# EAGLE design thunder (EAGLE 7.1.0)
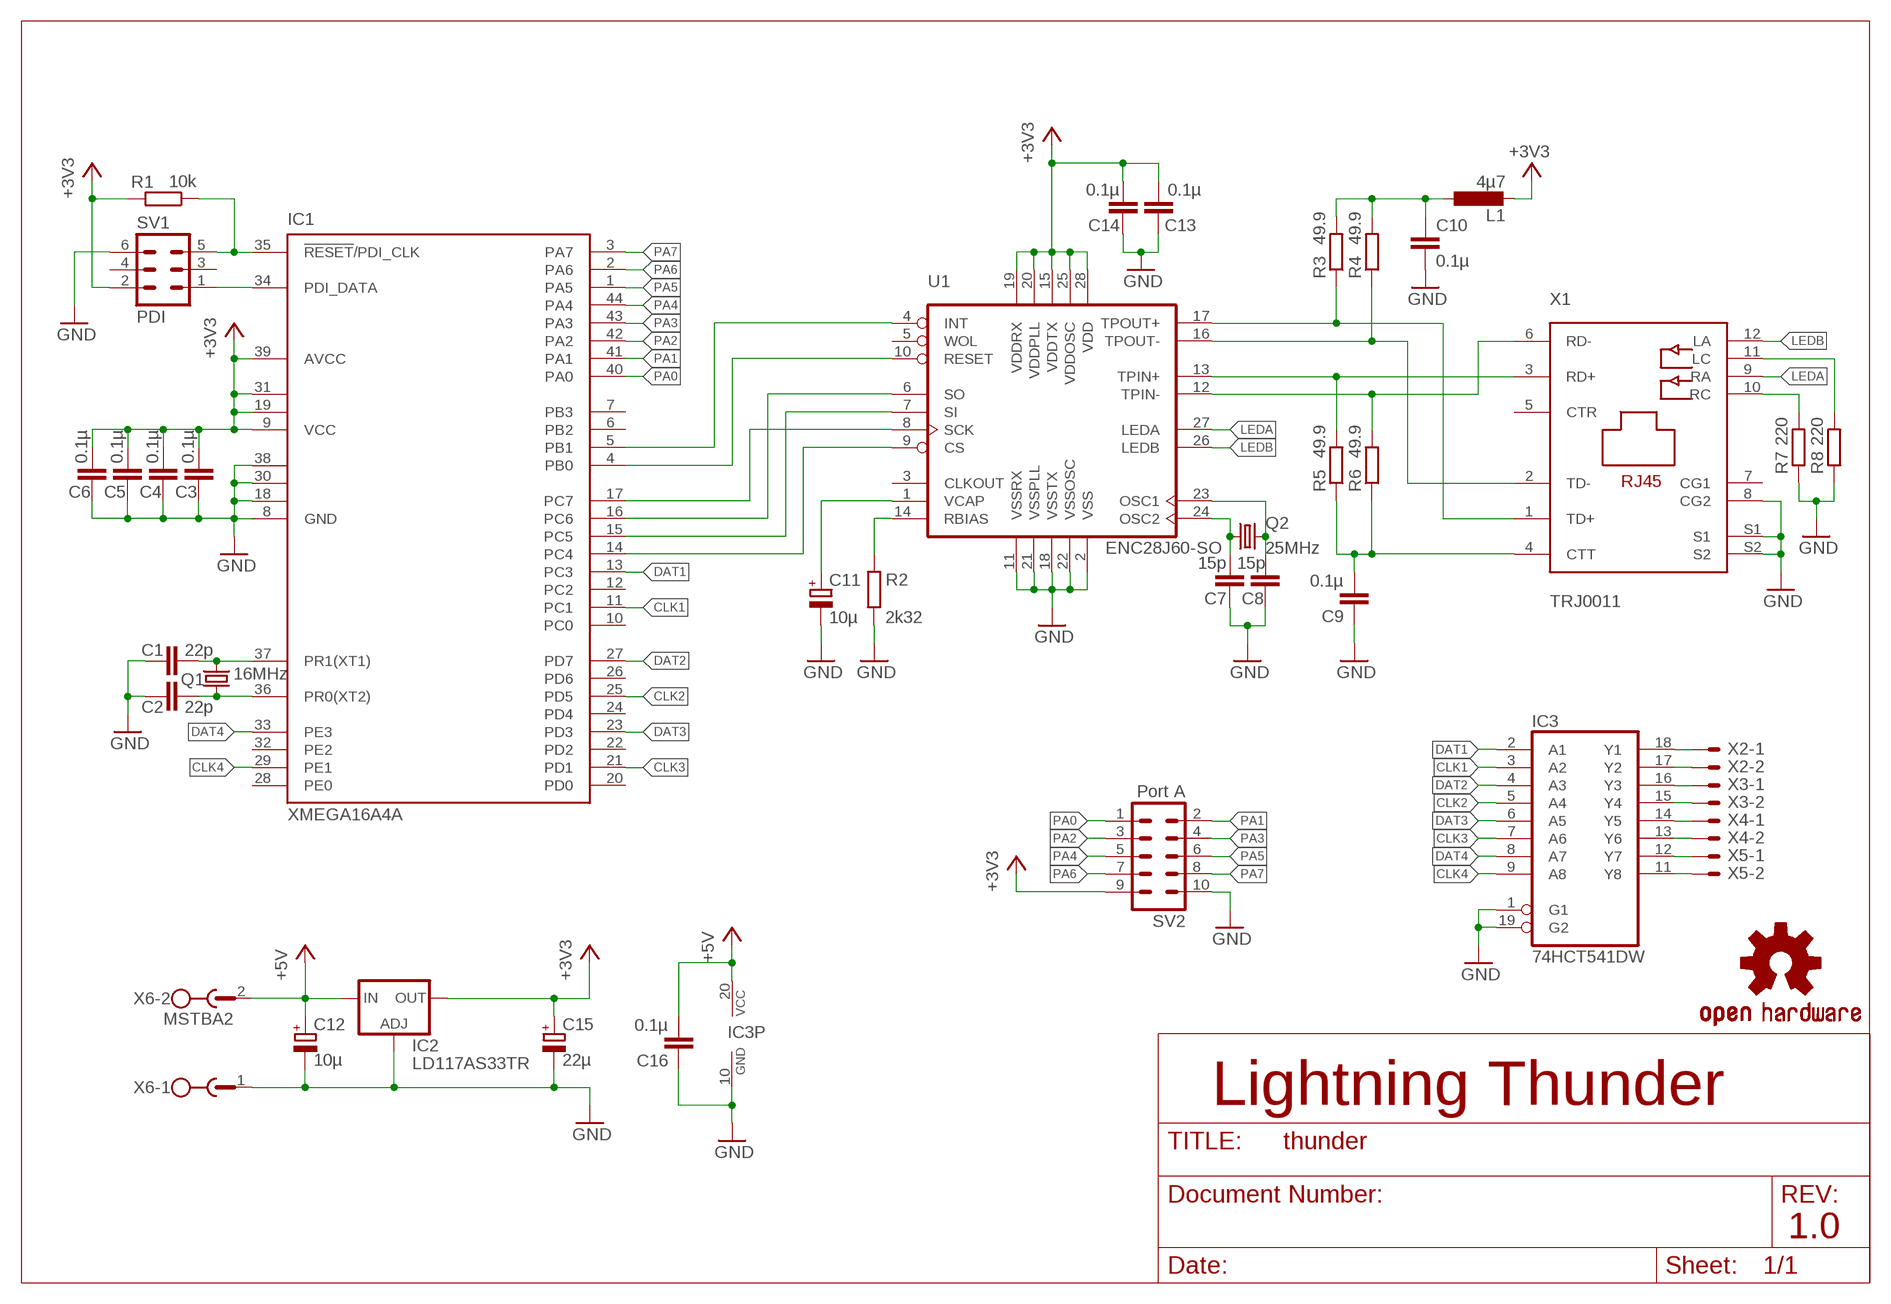
[diagram p0: schematic, sheet 1]

## Parts
C1  22p  C-EUC0805  [C0805]
C2  22p  C-EUC0805  [C0805]
C3  0.1µ  C-EUC0805  [C0805]
C4  0.1µ  C-EUC0805  [C0805]
C5  0.1µ  C-EUC0805  [C0805]
C6  0.1µ  C-EUC0805  [C0805]
C7  15p  C-EUC0805  [C0805]
C8  15p  C-EUC0805  [C0805]
C9  0.1µ  C-EUC0805  [C0805]
C10  0.1µ  C-EUC0805  [C0805]
C11  10µ  CPOL-EUB/3528-21R  [B/3528-21R]
C12  10µ  CPOL-EUB/3528-21R  [B/3528-21R]
C13  0.1µ  C-EUC0805  [C0805]
C14  0.1µ  C-EUC0805  [C0805]
C15  22µ  CPOL-EUB/3528-21R  [B/3528-21R]
C16  0.1µ  C-EUC0805  [C0805]
IC1  XMEGA16A4A  [TQFP44]
IC2  LD117AS33TR  [SOT223]
IC3  74HCT541DW  [SO20W]
L1  4µ7  L-EUL3225M  [L3225M]
LOGO1  OSHW-LOGOS  [OSHW-LOGO-S]
Q1  16MHz  CRYSTALHC49U-V  [HC49U-V]
Q2  25MHz  CRYSTALHC49U-V  [HC49U-V]
R1  10k  R-EU_R0805  [R0805]
R2  2k32  R-EU_R0805  [R0805]
R3  49.9  R-EU_R0805  [R0805]
R4  49.9  R-EU_R0805  [R0805]
R5  49.9  R-EU_R0805  [R0805]
R6  49.9  R-EU_R0805  [R0805]
R7  220  R-EU_R0805  [R0805]
R8  220  R-EU_R0805  [R0805]
SV1  PDI  ML6  [ML6]
SV2  Port A  MA05-2  [MA05-2]
U1  ENC28J60-SO  [SO28W]
X1  TRJ0011  [TRJ0011]
X2  AKL18X-02W  [AKL182-02]
X3  AKL18X-02W  [AKL182-02]
X4  AKL18X-02W  [AKL182-02]
X5  AKL18X-02W  [AKL182-02]
X6  MSTBA2  [MSTBA2]

## Nets
+3V3: C3.2 C4.2 C5.2 C6.2 C13.2 C14.2 C15.+ IC1.9(VCC) IC1.19(VCC1) IC1.31(VCC2) IC1.39(AVCC) IC2.4(OUT) L1.2 R1.2 SV1.2 SV2.9 U1.15(VDDTX) U1.19(VDDRX) U1.20(VDDPLL) U1.25(VDDOSC) U1.28(VDD)
+5V: C12.+ C16.2 IC2.3(IN) IC3.20(VCC) X6.2
CLK1: IC1.11(PC1) IC3.3(A2)
CLK2: IC1.25(PD5) IC3.5(A4)
CLK3: IC1.21(PD1) IC3.7(A6)
CLK4: IC1.29(PE1) IC3.9(A8)
DAT1: IC1.13(PC3) IC3.2(A1)
DAT2: IC1.27(PD7) IC3.4(A3)
DAT3: IC1.23(PD3) IC3.6(A5)
DAT4: IC1.33(PE3) IC3.8(A7)
GND: C1.1 C2.1 C3.1 C4.1 C5.1 C6.1 C7.1 C8.1 C9.1 C10.2 C11.- C12.- C13.1 C14.1 C15.- C16.1 IC1.8(GND) IC1.18(GND1) IC1.30(GND2) IC1.38(GND3) IC2.1(ADJ) IC3.1(G1) IC3.10(GND) IC3.19(G2) R2.1 R7.1 R8.1 SV1.6 SV2.10 U1.2(VSS) U1.11(VSSRX) U1.18(VSSTX) U1.21(VSSPLL) U1.22(VSSOSC) X1.8(CG2) X1.S1 X1.S2 X6.1
LEDA: U1.27(LEDA) X1.9(RA)
LEDB: U1.26(LEDB) X1.12(LA)
N$1: IC1.34(PDI_DATA) SV1.1
N$2: IC1.35(!RESET!/PDI_CLK) R1.1 SV1.5
N$3: C2.2 IC1.36(PR0(XT2)) Q1.1
N$4: C1.2 IC1.37(PR1(XT1)) Q1.2
N$5: IC1.14(PC4) U1.9(CS)
N$6: IC1.17(PC7) U1.8(SCK)
N$7: IC1.16(PC6) U1.6(SO)
N$8: IC1.15(PC5) U1.7(SI)
N$9: IC1.4(PB0) U1.10(RESET)
N$10: IC1.5(PB1) U1.4(INT)
N$11: R3.1 U1.17(TPOUT+) X1.1(TD+)
N$12: R4.1 U1.16(TPOUT-) X1.2(TD-)
N$13: R5.2 U1.13(TPIN+) X1.3(RD+)
N$14: R6.2 U1.12(TPIN-) X1.6(RD-)
N$15: R2.2 U1.14(RBIAS)
N$16: C10.1 L1.1 R3.2 R4.2
N$17: C9.2 R5.1 R6.1 X1.4(CTT)
N$18: C11.+ U1.1(VCAP)
N$19: IC3.18(Y1) X2.P$1
N$20: C7.2 Q2.1 U1.24(OSC2)
N$21: C8.2 Q2.2 U1.23(OSC1)
N$22: IC3.17(Y2) X2.P$2
N$23: IC3.16(Y3) X3.P$1
N$24: IC3.15(Y4) X3.P$2
N$25: R7.2 X1.10(RC)
N$26: R8.2 X1.11(LC)
N$27: IC3.14(Y5) X4.P$1
N$28: IC3.13(Y6) X4.P$2
N$29: IC3.12(Y7) X5.P$1
N$30: IC3.11(Y8) X5.P$2
PA0: IC1.40(PA0) SV2.1
PA1: IC1.41(PA1) SV2.2
PA2: IC1.42(PA2) SV2.3
PA3: IC1.43(PA3) SV2.4
PA4: IC1.44(PA4) SV2.5
PA5: IC1.1(PA5) SV2.6
PA6: IC1.2(PA6) SV2.7
PA7: IC1.3(PA7) SV2.8
Unconnected: IC1.6(PB2) IC1.7(PB3) IC1.10(PC0) IC1.12(PC2) IC1.20(PD0) IC1.22(PD2) IC1.24(PD4) IC1.26(PD6) IC1.28(PE0) IC1.32(PE2) SV1.3 SV1.4 U1.3(CLKOUT) U1.5(WOL) X1.5(CTR) X1.7(CG1)

## Notes on the sheet
- Lightning Thunder
- 1.0

## Library data of the parts
C1-C10 C13 C14 C16 = rcl:C-EU: CAPACITOR, European symbol
C11 C12 C15 = rcl:CPOL-EU: POLARIZED CAPACITOR, European symbol
IC1 = atmel:XMEGA16A4: MICROCONTROLLER Features High-performance, Low-power 8/16-bit AVR XMEGA Microcontroller Non-Volatile Program and Data Memories - 16 KB - 128 KB of In-System Self-Programmable Flash - 4 KB - 8 KB Boot Code Section with Independent Lock Bits - 1 KB - 2 KB EEPROM - 2 KB - 8 KB Internal SRAM Peripheral Features - Four-channel DMA Controller with support for external requests - Eight-channel Event System - Five 16-bit Timer/Counters Three Timer/Counters with 4 Output Compare or Input Capture channels Two Timer/Counters with 2 Output Compare or Input Capture channels High-Resolution Extensions on all Timer/Counters Advanced Waveform Extension on one Timer/Counter - Five USARTs IrDA Extension on one USART - Two Two-Wire Interfaces with dual address match (I2C and SMBus compatible) - Two SPIs (Serial Peripheral Interfaces) peripherals - AES and DES Crypto Engine - 16-bit Real Time Counter with Separate Oscillator - One Twelve-channel, 12-bit, 2 Msps Analog to Digital Converter - One Two-channel, 12-bit, 1 Msps Digital to Analog Converter - Two Analog Comparators with Window compare function - External Interrupts on all General Purpose I/O pins - Programmable Watchdog Timer with Separate On-chip Ultra Low Power Oscillator Special Microcontroller Features - Power-on Reset and Programmable Brown-out Detection - Internal and External Clock Options with PLL - Programmable Multi-level Interrupt Controller - Sleep Modes: Idle, Power-down, Standby, Power-save, Extended Standby - Advanced Programming, Test and Debugging Interfaces PDI (Program and Debug Interface) for programming, test and debugging I/O and Packages - 34 Programmable I/O Lines - 44 - lead TQFP - 44 - pad VQFN/QFN - 49 - ball VFBGA Operating Voltage - 1.6 - 3.6V Speed performance - 0 - 12 MHz @ 1.6 - 3.6V - 0 - 32 MHz @ 2.7 - 3.6V Drawn by Dipl.-Ing. (FH) Robert Siegler Created: 27.05.09; OC_FARNELL: unknown; OC_NEWARK: unknown
IC2 = v-reg:LD117A?*: Low drop fixed and adjustable positive voltage regulators 1 A Source: http://www.st.com/stonline/products/literature/ds/7194/ld1117axx.pdf
IC3 = 74xx-eu:74*541: Octal BUFFER and LINE DRIVER, 3-state
L1 = rcl:L-EU: INDUCTOR, European symbol
LOGO1 = SparkFun-Aesthetics:OSHW-LOGO: Open Source Hardware Logo This logo indicates the piece of hardware it is found on incorporates a OSHW license and/or adheres to the definition of open source hardware found here: http://freedomdefined.org/OSHW
Q1 Q2 = crystal:CRYSTAL: CRYSTAL; OC_FARNELL: 1666969; OC_NEWARK: unknown
R1-R8 = rcl:R-EU_: RESISTOR, European symbol
SV1 = con-ml:ML6: HARTING; OC_FARNELL: unknown; OC_NEWARK: unknown
SV2 = con-lstb:MA05-2: PIN HEADER; OC_FARNELL: unknown; OC_NEWARK: unknown
U1 = enc28j60centered:ENC28J60-*: Microchip 10Mbit Ethernet controller with SPI interface Improved SOIC28 layout (pads in 0.01 raster, pin1 slightly smaller). Pin 6 (SO) changed from Out (paralleling several Outs gives an error) to OC. Author: Profi from mikrocontroller.net - forum Date: 2006.0827
X1 = trj0011:TRJ0011
X2-X5 = con-riacon_akl:AKL18X-02: Riacon AKL18X Steckverbinder 2-Pol Grid = 3,5mm
X6 = con-phoenix-508:MSTBA2: PHOENIX; MF: FARNELL; MPN: 1757242; OC_FARNELL: 3705171; OC_NEWARK: 71C4161

## Board
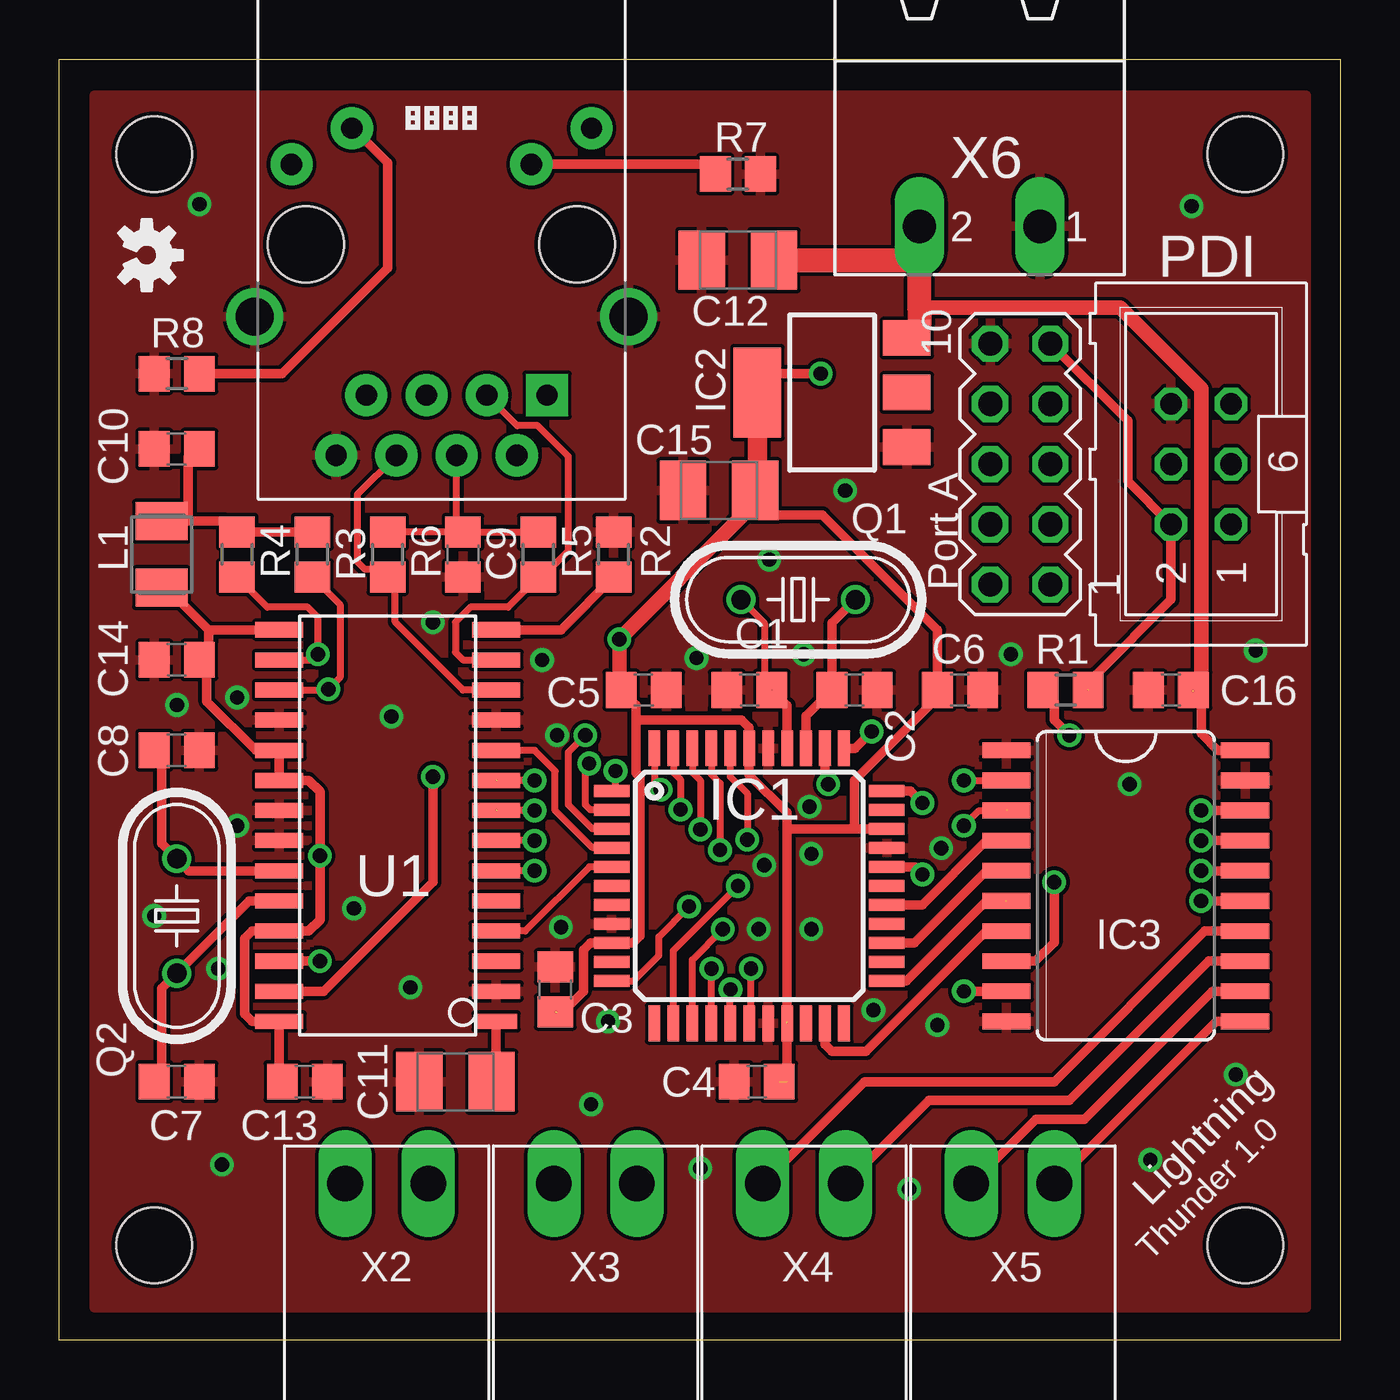
[diagram p1: board, top side]
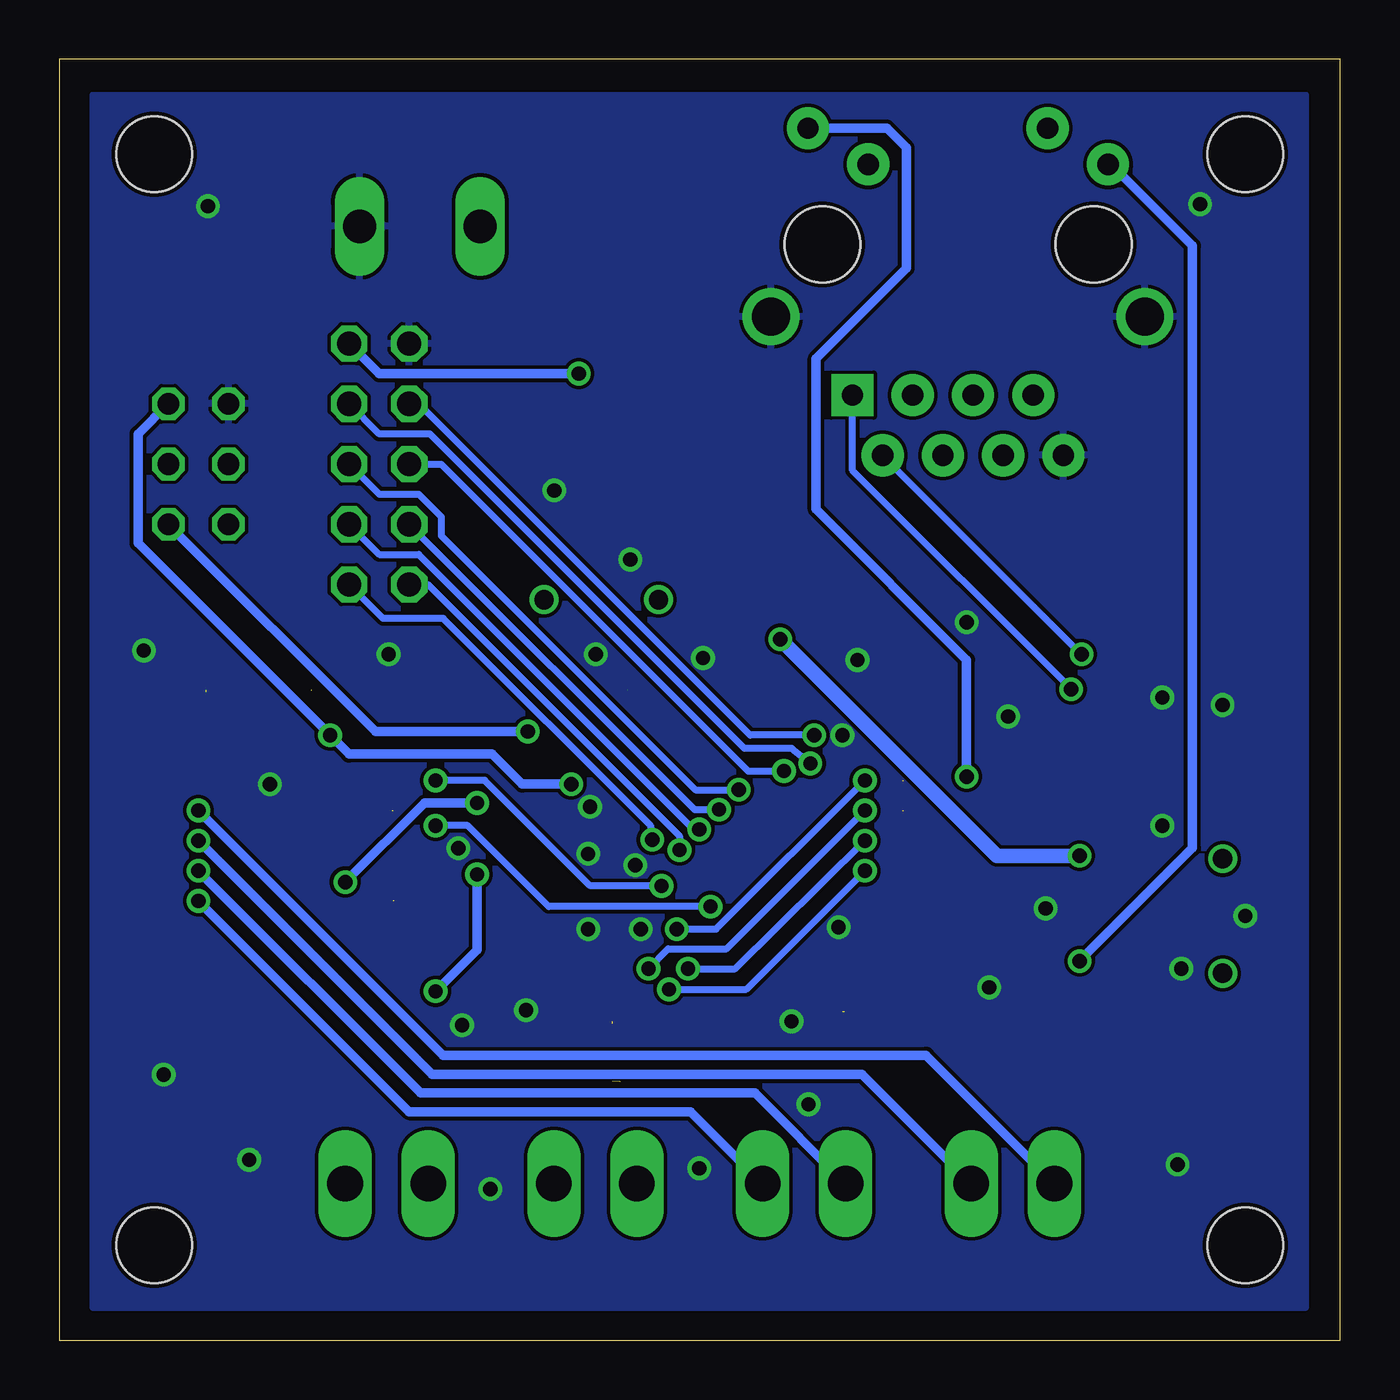
[diagram p2: board, bottom side, seen from below]

Size 54 x 54 mm. Coordinates in mm from the lower left corner, seen from the top.
Outline: 0,54 54,54 54,0 0,0 0,54
Copper layers (1*16): Top 0.035mm / dielectric 1.5mm / Bottom 0.035mm
Design rules "default": minimum track width 0.15mm, minimum drill 0.3mm, track to track 0.15mm, track to pad 0.15mm, pad to pad 0.15mm, via to via 0.15mm, smd to smd 0mil, copper to edge 0.2mm, drill to drill 0.2mm, minimum pad ring 0.2mm, minimum via ring 0.2mm, stop-mask expansion 4mil, vias tented up to drill 0.8mm, thermal gap 0.15mm
Holes 3.2 mm at 4,4 50,4 50,50 4,50

### Footprints (pad centres in the part's own frame; a part is rotated, then mirrored left to right if it is on the bottom)
C0805 = smd 1.3 x 1.5: 1 -0.95,0; 2 0.95,0
B/3528-21R = smd 1.95 x 2.5: + 1.525,0; - -1.525,0
TQFP44 = smd 1.5 x 0.5: 1 -5.8,4; 2 -5.8,3.2; 3 -5.8,2.4; 4 -5.8,1.6; 5 -5.8,0.8; 6 -5.8,0; 7 -5.8,-0.8; 8 -5.8,-1.6; 9 -5.8,-2.4; 10 -5.8,-3.2; 11 -5.8,-4; 23 5.8,-4; 24 5.8,-3.2; 25 5.8,-2.4; 26 5.8,-1.6; 27 5.8,-0.8; 28 5.8,0; 29 5.8,0.8; 30 5.8,1.6; 31 5.8,2.4; 32 5.8,3.2; 33 5.8,4 | smd 0.5 x 1.5: 12 -4,-5.8; 13 -3.2,-5.8; 14 -2.4,-5.8; 15 -1.6,-5.8; 16 -0.8,-5.8; 17 0,-5.8; 18 0.8,-5.8; 19 1.6,-5.8; 20 2.4,-5.8; 21 3.2,-5.8; 22 4,-5.8; 34 4,5.8; 35 3.2,5.8; 36 2.4,5.8; 37 1.6,5.8; 38 0.8,5.8; 39 0,5.8; 40 -0.8,5.8; 41 -1.6,5.8; 42 -2.4,5.8; 43 -3.2,5.8; 44 -4,5.8
SOT223 = smd 1.5 x 2: 1 -2.3,-3.15; 2 0,-3.15; 3 2.3,-3.15 | smd 3.8 x 2: 4 0,3.15
SO20W = smd 0.66 x 2.032: 1 -5.715,-5.029; 2 -4.445,-5.029; 3 -3.175,-5.029; 4 -1.905,-5.029; 5 -0.635,-5.029; 6 0.635,-5.029; 7 1.905,-5.029; 8 3.175,-5.029; 9 4.445,-5.029; 10 5.715,-5.029; 11 5.715,5.029; 12 4.445,5.029; 13 3.175,5.029; 14 1.905,5.029; 15 0.635,5.029; 16 -0.635,5.029; 17 -1.905,5.029; 18 -3.175,5.029; 19 -4.445,5.029; 20 -5.715,5.029
L3225M = smd 1.6 x 2.2: 1 -1.4,0; 2 1.4,0
HC49U-V = drill 0.813: 1 -2.413,0; 2 2.413,0
R0805 = smd 1.3 x 1.5: 1 -0.95,0; 2 0.95,0
ML6 = drill 0.914 octagon: 1 -2.54,-1.27; 2 -2.54,1.27; 3 0,-1.27; 4 0,1.27; 5 2.54,-1.27; 6 2.54,1.27
MA05-2 = drill 1.016 octagon: 1 -5.08,-1.27; 2 -5.08,1.27; 3 -2.54,-1.27; 4 -2.54,1.27; 5 0,-1.27; 6 0,1.27; 7 2.54,-1.27; 8 2.54,1.27; 9 5.08,-1.27; 10 5.08,1.27
SO28W = smd 0.635 x 1.778: 1 -8.255,-4.572 | smd 0.635 x 2.032: 2 -6.985,-4.572; 3 -5.715,-4.572; 4 -4.445,-4.572; 5 -3.175,-4.572; 6 -1.905,-4.572; 7 -0.635,-4.572; 8 0.635,-4.572; 9 1.905,-4.572; 10 3.175,-4.572; 11 4.445,-4.572; 12 5.715,-4.572; 13 6.985,-4.572; 14 8.255,-4.572; 15 8.255,4.572; 16 6.985,4.572; 17 5.715,4.572; 18 4.445,4.572; 19 3.175,4.572; 20 1.905,4.572; 21 0.635,4.572; 22 -0.635,4.572; 23 -1.905,4.572; 24 -3.175,4.572; 25 -4.445,4.572; 26 -5.715,4.572; 27 -6.985,4.572; 28 -8.255,4.572
TRJ0011 = drill 0.9 pad 1.778 square: 1 4.445,-6.35 | drill 0.9 pad 1.778: 2 3.175,-8.89; 3 1.905,-6.35; 4 0.635,-8.89; 5 -0.635,-6.35; 6 -1.905,-8.89; 7 -3.175,-6.35; 8 -4.445,-8.89; 9 6.325,4.902; 10 3.785,3.378; 11 -3.785,4.902; 12 -6.325,3.378 | drill 1.6: S1 -7.874,-3.048; S2 7.874,-3.048 | hole 3.2: -5.715,0; 5.715,0
AKL182-02 = drill 1.5 pad 2.184 long: P$1 -1.75,0; P$2 1.75,0
MSTBA2 = drill 1.397 long: 1 -2.54,5.08; 2 2.54,5.08

### Placement (x,y rotation side)
C1  29.09,27.41 0 top
C2  33.53,27.41 180 top
C3  20.91,14.79 270 top
C4  29.4,10.9 0 top
C5  24.64,27.41 180 top
C6  37.98,27.41 180 top
C7  4.95,10.9 180 top
C8  4.95,24.87 180 top
C9  17.02,33.12 90 top
C10  4.95,37.57 180 top
C11  16.7,10.9 0 top
C12  28.61,45.53 0 top
C13  10.35,10.9 180 top
C14  4.95,28.68 0 top
C15  27.81,35.82 0 top
C16  46.87,27.41 0 top
IC1  29.09,19.16 0 top
IC2  32.58,39.95 90 top
IC3  44.96,19.16 270 top
L1  4.32,33.12 270 top
LOGO1  3.68,45.75 270 top
Q1  31.15,31.22 180 top
Q2  4.95,17.88 90 top
R1  42.42,27.41 0 top
R2  23.37,33.12 270 top
R3  10.67,33.12 90 top
R4  7.5,33.12 90 top
R5  20.2,33.12 270 top
R6  13.84,33.12 270 top
R7  28.61,49.16 180 top
R8  4.95,40.74 0 top
SV1  48.14,36.94 90 top
SV2  40.52,36.94 90 top
U1  13.84,21.7 90 top
U$1  [LP_NUMBER_SILK_TOP]  14.4,50.83 0 top
X1  16.12,46.2 0 top
X2  13.8,6.6 0 top
X3  22.6,6.6 0 top
X4  31.4,6.6 0 top
X5  40.2,6.6 0 top
X6  38.8,52.04 180 top

### Tracks (layer width: path | path; a pad name or v marks a point on that pad's centre or on a via)
+3V3  (via drill 0.6)  (4 unrouted)
  Top 0.406: 6.3,29.95 6.3,29.16 C14.2 6.22,28.36 6.22,26.94 8.29,24.87 U1.19 U1.20 10.51,23.6 10.99,23.12 v10.99,20.42 10.99,17.73 10.51,17.25 U1.25 8.13,17.25 7.81,16.93 7.81,13.76 8.13,13.44 U1.28 9.27,11.03 C13.2 | 6.3,29.95 U1.15 | 6.3,29.95 4.56,31.7 L1.2 | 30.67,21.55 30.67,13.44 | IC1.31 33.53,21.55 | 33.53,21.55 30.67,21.55 | 33.53,21.55 33.53,23.6 37.02,27.09 C6.2 37.02,29.95 32.18,34.79 30.01,34.79 29.43,35.85 | IC1.19 30.69,10.91 30.67,10.9 | 30.67,21.55 30.67,22.25 29.09,23.84 IC1.39 29.09,25.82 28.77,26.14 24.32,26.14 | 24.32,26.14 24.32,23.92 24.48,23.76 24.48,17.05 24.18,16.75 IC1.9 22.4,16.75 22.1,16.46 22.1,14.71 21.23,13.84 20.99,13.84 | 24.32,26.14 24.32,26.78 C5.2 | SV2.9 45.04,38.76 45.04,36.22 SV1.2 46.87,31.22 43.69,28.05 43.69,27.73 R1.2 | v32.1,40.74 29.64,40.74 29.43,40.53 IC2.4
  Top 0.61: C15.+ 28.77,35.25 28.77,34.71 v23.61,29.55 23.61,27.49 C5.2
  Top 0.813: IC2.4 29.43,35.85 29.4,35.82
  Bottom 0.406: SV2.9 40.52,40.74 v32.1,40.74
  Bottom 0.61: v10.99,20.42 14.48,20.42 v23.61,29.55
+5V  (1 unrouted)
  Top 0.406: IC3.20 48.85,24.87 48.14,25.58 48.14,27.01 47.82,27.33 47.9,27.41
  Top 0.61: C16.2 48.14,27.73 48.14,40.11 44.72,43.52 36.26,43.52
  Top 1.016: IC2.3 36.26,42.78 36.26,43.52 36.26,45.51 | C12.+ 36.2,45.53 | 36.2,45.53 36.23,45.51 | 36.26,45.51 X6.2 | 36.2,45.53 36.24,45.53 36.26,45.51
CLK1  (via drill 0.6)  (1 unrouted)
  Top 0.305: IC1.11 24.21,15.16 25.27,16.22 25.27,17.01 v26.55,18.28 | v38.13,21.7 38.77,22.33 39.96,22.33
  Bottom 0.305: v26.55,18.28 33.37,18.28 36.78,21.7 v38.13,21.7
CLK2
  Top 0.406: IC1.25 36.05,16.75 39.09,19.79 IC3.5
CLK3
  Top 0.406: IC1.21 32.28,12.46 32.58,12.17 34.01,12.17 39.09,17.25 IC3.7
CLK4  (via drill 0.6)
  Top 0.406: IC1.29 36.06,19.95 v36.39,19.63 | v38.13,14.71 IC3.9
  Bottom 0.406: v36.39,19.63 36.39,16.46 v38.13,14.71
DAT1  (via drill 0.6)
  Top 0.305: IC1.13 25.88,16.43 v28.61,19.16 | v38.13,23.6 IC3.2
  Bottom 0.305: v28.61,19.16 31.62,19.16 36.07,23.6 v38.13,23.6
DAT2
  Top 0.406: IC1.27 36.38,18.35 39.09,21.06 IC3.4
DAT3  (1 unrouted)
  Top 0.406: IC1.23 35.72,15.16 39.09,18.52 39.88,18.52
DAT4  (via drill 0.6)
  Top 0.406: IC1.33 35.88,23.16 v36.39,22.65 | v41.94,19.31 41.94,16.77 41.15,15.98 IC3.8
  Bottom 0.406: v36.39,22.65 38.61,22.65 v41.94,19.31
GND  (via drill 0.6)
  other vias: 15.75,30.27 31.62,22.49 29.92,32.91 14,26.3 35.83,6.38 33.13,35.82 47.74,47.81 6.86,7.41 31.7,20.5 45.12,23.44 21.15,17.41 37.02,13.28 27.02,7.25 37.18,20.74 12.42,18.2 14.8,14.87 4.95,26.77 7.5,21.7 4,17.88 6.7,15.66 20.35,28.68 34.32,13.92 7.5,27.09 5.91,47.89 46,7.6 49.6,11.2 31.39,28.92 29.48,17.33 31.7,17.33 29.72,20.03 26.86,28.76 20.99,25.51 23.13,13.44 22.42,9.95 40.12,28.92 50.44,29.08
  pour Bottom: 1.46,1.38 52.58,1.38 52.58,52.49 1.46,52.49
  pour Top: 1.46,52.49 52.58,52.49 52.58,1.38 1.46,1.38
LEDA  (via drill 0.6)
  Top 0.406: U1.27 11.15,14.71 15.75,19.31 v15.75,23.76
  Bottom 0.406: X1.9 19.12,51.1 18.29,50.27 18.29,45.19 22.1,41.38 22.1,35.03 15.75,28.68 v15.75,23.76
LEDB  (via drill 0.6)
  Top 0.406: U1.26 v10.99,15.98
  Bottom 0.406: v10.99,15.98 6.23,20.74 6.23,46.14 9.47,49.39 X1.12
N$1  (via drill 0.6)
  Top 0.406: IC1.34 33.54,24.95 v34.24,25.66
  Bottom 0.406: v34.24,25.66 40.67,25.66 SV1.1
N$2  (via drill 0.6)
  Top 0.406: IC1.35 32.28,23.58 v32.42,23.44 | v42.58,25.51 41.94,26.14 41.94,26.94 R1.1
  Bottom 0.406: v32.42,23.44 34.48,23.44 35.75,24.71 41.78,24.71 v42.58,25.51 50.67,33.6 50.67,38.2 SV1.5
N$3
  Top 0.406: IC1.36 31.48,26.31 C2.2 32.58,30.24 Q1.1
N$4  (1 unrouted)
  Top 0.305: Q1.2 29.72,30.24 29.72,28.05 30.04,27.73 C1.2
  Top 0.406: IC1.37 30.69,26.76 C1.2
N$5  (via drill 0.6)  (1 unrouted)
  Top 0.305: IC1.14 26.69,16.04 v27.97,17.33 | v20.04,23.6 18.45,23.6
  Bottom 0.305: v27.97,17.33 26.31,17.33 v20.04,23.6
N$6  (via drill 0.6)  (1 unrouted)
  Top 0.305: IC1.17 29.09,13.52 29.16,13.6 v29.16,15.66 | v20.04,22.33 18.45,22.33
  Bottom 0.305: v29.16,15.66 28.33,16.5 25.87,16.5 v20.04,22.33
N$7  (via drill 0.6)
  Top 0.305: IC1.16 28.28,14.7 v28.29,14.79 | v20.04,19.79 U1.6
  Bottom 0.305: v28.29,14.79 25.04,14.79 v20.04,19.79
N$8  (via drill 0.6)
  Top 0.305: IC1.15 27.48,15.57 v27.5,15.66 | v20.04,21.06 U1.7
  Bottom 0.305: v27.5,15.66 25.51,15.66 v20.04,21.06
N$9
  Top 0.305: IC1.4 22.48,20.76 20.91,22.33 20.91,24 20.04,24.87 U1.10
N$10
  Top 0.305: IC1.5 22.34,19.95 19.64,17.25 U1.4
N$11  (via drill 0.6)
  Top 0.305: U1.17 11.3,27.41 v11.34,27.45 11.86,27.96 11.86,30.98 R3.1
  Bottom 0.305: v11.34,27.45 20.56,36.66 X1.1
N$12  (via drill 0.6)
  Top 0.305: U1.16 10.67,28.68 v10.91,28.91 10.91,30.47 10.47,30.9 8.77,30.9 R4.1
  Bottom 0.305: v10.91,28.91 X1.2
N$13
  Top 0.305: U1.13 17.02,28.68 16.7,29 16.7,30.27 17.34,30.9 18.92,30.9 R5.2 20.83,32.65 21.47,33.28 21.47,37.25 20.16,38.55 19.31,38.55 X1.3
N$14
  Top 0.305: U1.12 17.02,27.41 14.16,30.27 14.16,31.85 R6.2 13.53,32.49 12.89,32.49 12.57,32.81 12.57,35.66 X1.6
N$15
  Top 0.406: U1.14 21.15,29.95 R2.2
N$16
  Top 0.406: R3.2 R4.2 7.05,34.52 5.43,34.52 | 5.43,34.52 L1.1 | C10.1 5.43,37.25 5.43,34.52
N$17
  Top 0.305: C9.2 R6.1 | C9.2 16.75,34.34 X1.4 | C9.2 R5.1
N$18
  Top 0.406: U1.1 18.42,11.09 C11.+
N$19  (via drill 0.6)
  Top 0.406: IC3.18 v48.14,22.33
  Bottom 0.406: v48.14,22.33 37.82,12.01 17.46,12.01 X2.P$1
N$20
  Top 0.406: U1.24 8,18.52 Q2.1 4.32,14.84 4.32,11.22 C7.2
N$21
  Top 0.406: U1.23 5.46,19.79 Q2.2 4.32,20.93 4.32,24.23 4,24.55 C8.2
N$22  (via drill 0.6)
  Top 0.406: IC3.17 v48.14,21.06
  Bottom 0.406: v48.14,21.06 38.29,11.22 20.17,11.22 X2.P$2
N$23  (via drill 0.6)
  Top 0.406: IC3.16 v48.14,19.79
  Bottom 0.406: v48.14,19.79 38.77,10.42 24.67,10.42 X3.P$1
N$24  (via drill 0.6)
  Top 0.406: IC3.15 v48.14,18.52
  Bottom 0.406: v48.14,18.52 39.24,9.63 27.38,9.63 X3.P$2
N$25
  Top 0.406: X1.10 27.28,49.57 R7.2
N$26
  Top 0.406: R8.2 9.4,40.74 13.84,45.19 13.84,49.64 12.38,51.1 X1.11
N$27
  Top 0.406: IC3.14 48.29,17.25 41.94,10.9 33.95,10.9 X4.P$1
N$28
  Top 0.406: IC3.13 48.45,15.98 42.58,10.11 36.66,10.11 X4.P$2
N$29
  Top 0.406: IC3.12 48.61,14.71 43.21,9.31 41.16,9.31 X5.P$1
N$30
  Top 0.406: IC3.11 48.77,13.44 41.95,6.62 X5.P$2
PA0  (via drill 0.6)
  Top 0.305: IC1.40 28.28,23.77 29.01,23.04 v29.01,21.1
  Bottom 0.305: v29.01,21.1 29.09,21.7 37.82,30.43 40.36,30.43 SV2.1
PA1  (via drill 0.6)
  Top 0.305: IC1.41 27.48,23.85 27.85,23.48 v27.85,20.66
  Bottom 0.305: SV2.2 38.45,31.85 27.85,21.26 v27.85,20.66
PA2  (via drill 0.6)
  Top 0.305: IC1.42 26.69,23.94 27.02,23.6 v27.02,21.54
  Bottom 0.305: SV2.3 40.52,33.12 38.85,33.12 27.26,21.54 v27.02,21.54
PA3  (via drill 0.6)
  Top 0.305: IC1.43 25.88,23.94 26.19,23.64 v26.19,22.37
  Bottom 0.305: SV2.4 27.22,22.37 v26.19,22.37
PA4  (via drill 0.6)
  Top 0.305: IC1.44 25.09,23.47 v25.35,23.2
  Bottom 0.305: SV2.5 40.52,35.66 38.85,35.66 37.9,34.71 37.9,33.92 27.18,23.2 v25.35,23.2
PA5  (via drill 0.6)
  Top 0.305: IC1.1 23.5,23.16 23.45,23.2 v23.45,24
  Bottom 0.305: SV2.6 37.9,36.94 24.96,24 v23.45,24
PA6  (via drill 0.6)
  Top 0.305: IC1.2 22.39,22.35 22.18,22.57 22.18,24.16 v22.34,24.31
  Bottom 0.305: v22.34,24.31 23.13,24.95 25.12,24.95 38.37,38.2 40.52,38.2 SV2.7
PA7  (via drill 0.6)
  Top 0.305: IC1.3 22.48,21.55 21.47,22.57 21.47,24.79 v22.18,25.51
  Bottom 0.305: v22.18,25.51 24.88,25.51 38.85,39.48 SV2.8

### Text on the board
tPlace: Lightning | Thunder 1.0